# EAGLE design Metvoc (EAGLE 9.1.1)
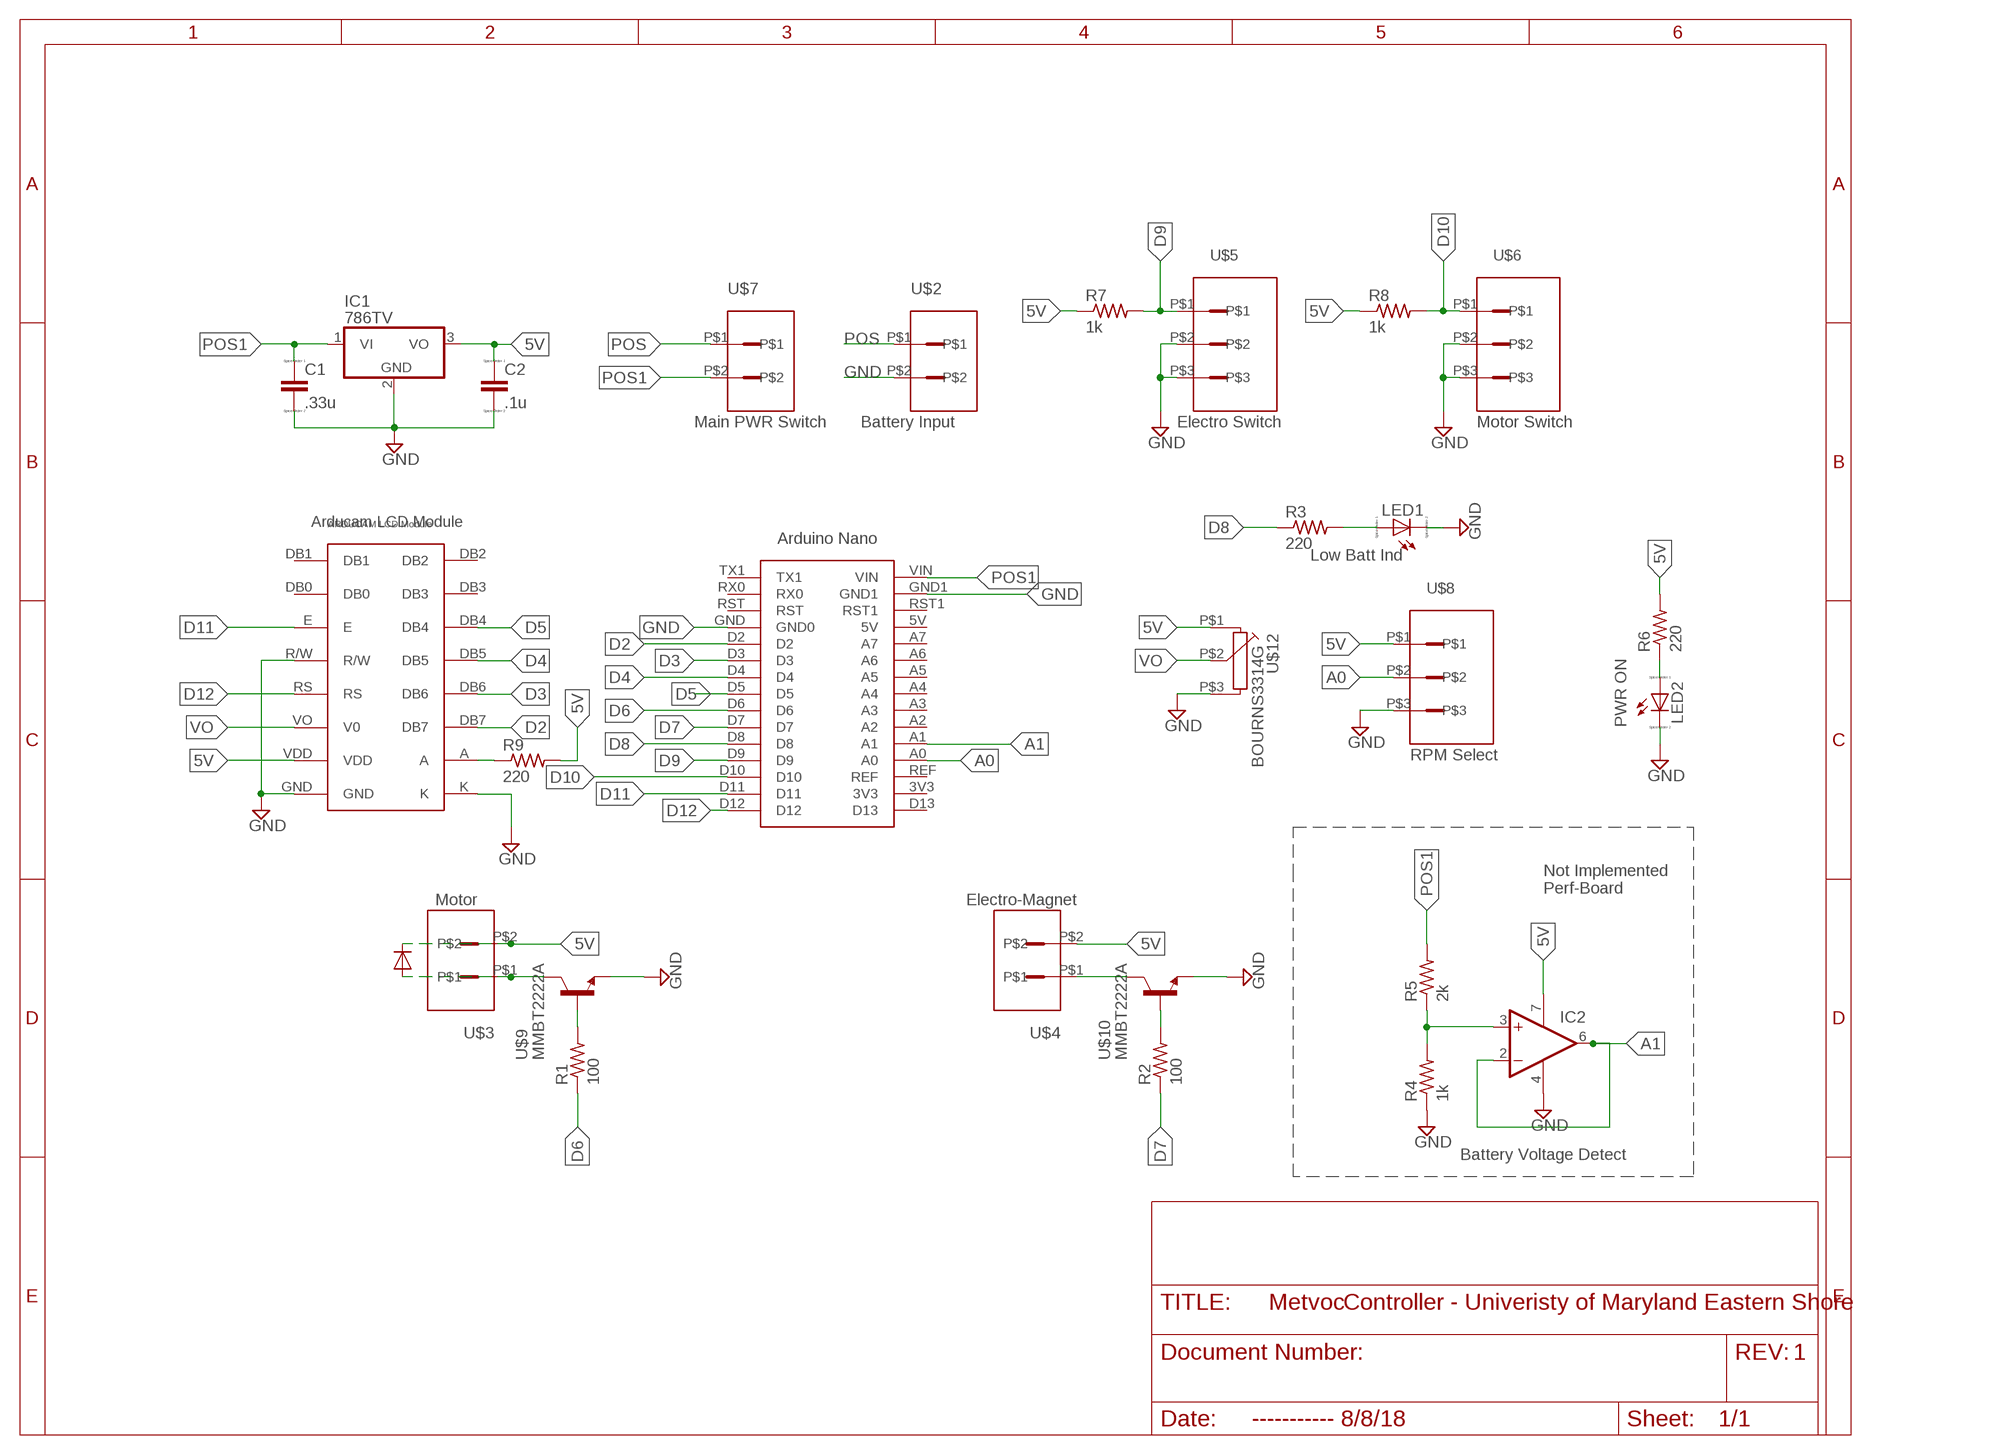
[diagram p0: schematic, sheet 1]

## Parts
C1  .33u  CC3216  [C3216]
C2  .1u  CC3216  [C3216]
IC1  786TV  [TO220V]
IC2  1AMP_P7+4D  [SO08]
LED1  LED_E  [LED_1206]
LED2  LED_E  [LED_1206]
R1  100  R-US_M1206  [M1206]
R2  100  R-US_M1206  [M1206]
R3  220  R-US_M1206  [M1206]
R4  1k  R-US_M1206  [M1206]
R5  2k  R-US_M1206  [M1206]
R6  220  R-US_M3216  [M3216]
R7  1k  R-US_M1206  [M1206]
R8  1k  R-US_M1206  [M1206]
R9  220  R-US_M1206  [M1206]
U$1  ARDUINO_NANO  [ARDUINONANO]
U$2  KF2510-2  [KF2540-2]
U$3  KF2510-2  [KF2540-2]
U$4  KF2510-2  [KF2540-2]
U$5  KF2510-3  [KF2540-3]
U$6  KF2510-3  [KF2540-3]
U$7  KF2510-2  [KF2540-2]
U$8  KF2510-3  [KF2540-3]
U$9  MMBT2222A  [SOT23]
U$10  MMBT2222A  [SOT23]
U$11  LCDMODULE  [LCDSCREEN]
U$12  BOURNS3314G  [3314POT]

## Nets
5V: C2.1 IC1.3(VO) IC2.7(V+) R6.2 R7.1 R8.1 R9.2 U$3.P$2 U$4.P$2 U$8.P$1 U$11.VDD U$12.P$1(1A)
A0: U$1.A0 U$8.P$2
A1: IC2.2(-IN) IC2.6(OUT) U$1.A1
D2: U$1.D2 U$11.DB7
D3: U$1.D3 U$11.DB6
D4: U$1.D4 U$11.DB5
D5: U$1.D5 U$11.DB4
D6: R1.1 U$1.D6
D7: R2.1 U$1.D7
D8: R3.1 U$1.D8
D9: R7.2 U$1.D9 U$5.P$1
D10: R8.2 U$1.D10 U$6.P$1
D11: U$1.D11 U$11.E
D12: U$1.D12 U$11.RS
GND: C1.2 C2.2 IC1.2(GND) IC2.4(V-) LED1.C LED2.C R4.1 U$1.GND1 U$1.GND(GND0) U$2.P$2 U$5.P$2 U$5.P$3 U$6.P$2 U$6.P$3 U$8.P$3 U$9.2(E) U$10.2(E) U$11.GND U$11.K U$11.R/W U$12.P$3(1E)
N$1: R1.2 U$9.1(B)
N$2: U$3.P$1 U$9.3(C)
N$3: U$4.P$1 U$10.3(C)
N$4: IC2.3(+IN) R4.2 R5.1
N$5: R2.2 U$10.1(B)
N$6: LED1.A R3.2
N$7: LED2.A R6.1
N$8: R9.1 U$11.A
POS: U$2.P$1 U$7.P$1
POS1: C1.1 IC1.1(VI) R5.2 U$1.VIN U$7.P$2
VO: U$11.VO(V0) U$12.P$2(1S)
Unconnected: U$1.3V3 U$1.5V U$1.A2 U$1.A3 U$1.A4 U$1.A5 U$1.A6 U$1.A7 U$1.D13 U$1.REF U$1.RST U$1.RST1 U$1.RX0 U$1.TX1 U$11.DB0 U$11.DB1 U$11.DB2 U$11.DB3

## Notes on the sheet
- Main PWR Switch | Battery Input | Electro Switch | Motor Switch
- Low Batt Ind
- PWR ON
- RPM Select
- Motor | Electro-Magnet
- Not Implemented 
  Perf-Board
- Battery Voltage Detect
- Controller - Univeristy of Maryland Eastern Shore
- 1
- ----------- 8/8/18

## Library data of the parts
C1 C2 = eagle-ltspice:C: CAPACITOR, European symbol; SPICEMODEL: NONE; SPICEPREFIX: C
IC1 = linear:78*: Positive VOLTAGE REGULATOR Source: http://cache.national.com/ds/LM/LM78L05.pdf http://www.fairchildsemi.com/ds/LM/LM7805.pdf
IC2 = linear:1AMP_P7+4: OP AMP
LED1 LED2 = eagle-ltspice:LED_E: LED Source: http://www.osram.convergy.de Source: www.luxeon.com Source: www.kingbright.com; SPICEMODEL: NONE; SPICEPREFIX: D; SPICETYPE: diode
R1-R9 = resistor:R-US_: RESISTOR, American symbol
U$1 = Metvoc:ARDUINO_NANO
U$2-U$4 U$7 = Metvoc:KF2510-2: KF2510-2 - 2 PIN Molex Connector
U$5 U$6 U$8 = Metvoc:KF2510-3: KF2510-3 - Molex Connector
U$9 U$10 = Metvoc:MMBT2222A: MMBT2222A - NPN Transistor
U$11 = Metvoc:LCDMODULE
U$12 = Metvoc:BOURNS3314G: Bourns 3314G-103ECT-ND - 10k Potentiometer

## Board
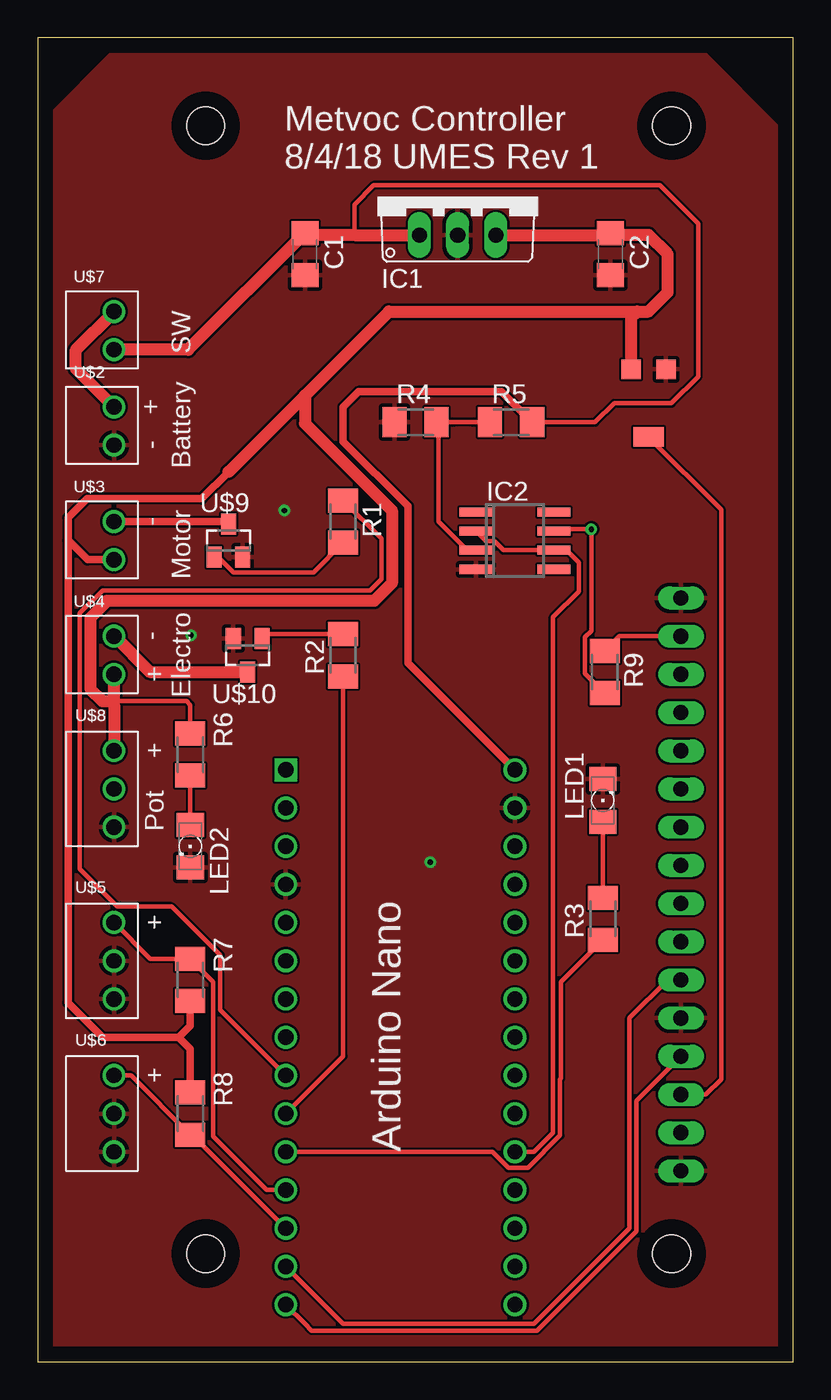
[diagram p1: board, top side]
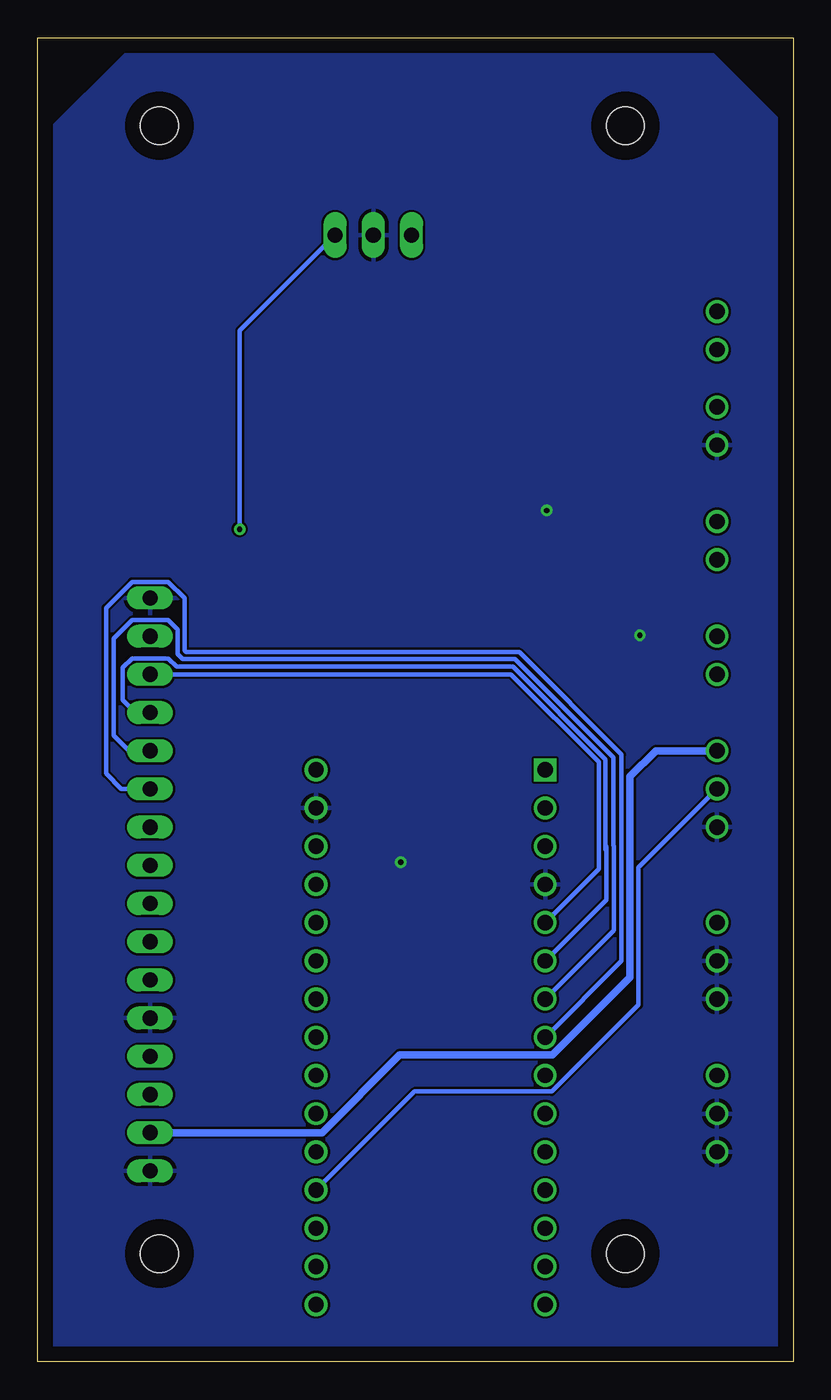
[diagram p2: board, bottom side, seen from below]

Size 50.27 x 88.06 mm. Coordinates in mm from the lower left corner, seen from the top.
Outline: 0,0 50.27,0 50.27,88.06 0,88.06 0,0
Copper layers (1*16): Top 0.035mm / dielectric 1.5mm / Bottom 0.035mm
Design rules "default": minimum track width 6mil, minimum drill 0.35mm, track to track 6mil, track to pad 6mil, pad to pad 6mil, via to via 6mil, smd to smd 6mil, copper to edge 40mil, drill to drill 6mil, minimum pad ring 10mil, minimum via ring 8mil, stop-mask expansion 4mil, vias tented up to drill 0mil, thermal gap 10mil

### Footprints (pad centres in the part's own frame; a part is rotated, then mirrored left to right if it is on the bottom)
C3216 = smd 1.6 x 1.8: 1 -1.4,0; 2 1.4,0
TO220V = drill 1.016 long: 1 -2.54,-2.54; 2 0,-2.54; 3 2.54,-2.54
SO08 = smd 0.6 x 2.2: 1 -1.905,-2.6; 2 -0.635,-2.6; 3 0.635,-2.6; 4 1.905,-2.6; 5 1.905,2.6; 6 0.635,2.6; 7 -0.635,2.6; 8 -1.905,2.6
LED_1206 = smd 1.6 x 1.803: A -1.422,0; C 1.422,0
M1206 = smd 1.6 x 2: 1 -1.4,0; 2 1.4,0
M3216 = smd 1.6 x 2: 1 -1.4,0; 2 1.4,0
ARDUINONANO = drill 1.016: 3V3 7.62,-15.24; 5V 7.62,10.16; A0 7.62,-10.16; A1 7.62,-7.62; A2 7.62,-5.08; A3 7.62,-2.54; A4 7.62,0; A5 7.62,2.54; A6 7.62,5.08; A7 7.62,7.62; D2 -7.62,7.62; D3 -7.62,5.08; D4 -7.62,2.54; D5 -7.62,0; D6 -7.62,-2.54; D7 -7.62,-5.08; D8 -7.62,-7.62; D9 -7.62,-10.16; D10 -7.62,-12.7; D11 -7.62,-15.24; D12 -7.62,-17.78; D13 7.62,-17.78; GND -7.62,10.16; GND1 7.62,15.24; REF 7.62,-12.7; RST -7.62,12.7; RST1 7.62,12.7; RX0 -7.62,15.24; VIN 7.62,17.78 | drill 1.016 square: TX1 -7.62,17.78
KF2540-2 = drill 1.016: P$1 0,1.27; P$2 0,-1.27
KF2540-3 = drill 1.016: P$1 0,2.54; P$2 0,0; P$3 0,-2.54
SOT23 = smd 1 x 1.4: 1 -0.95,-1.1; 2 0.95,-1.1; 3 0,1.1
LCDSCREEN = drill 1.016 long: A -16.12,35.56; DB0 -16.12,15.24; DB1 -16.12,17.78; DB2 -16.12,20.32; DB3 -16.12,22.86; DB4 -16.12,25.4; DB5 -16.12,27.94; DB6 -16.12,30.48; DB7 -16.12,33.02; E -16.12,12.7; GND -16.12,0; K -16.12,38.1; R/W -16.12,10.16; RS -16.12,7.62; VDD -16.12,2.54; VO -16.12,5.08 | hole 2.5: -15.5,-5.5; 15.5,-5.5; -15.5,69.5; 15.5,69.5
3314POT = smd 1.3 x 1.3: P$1 -1.15,2.25; P$3 1.15,2.25 | smd 2 x 1.3: P$2 0,-2.25

### Placement (x,y rotation side)
C1  17.78,73.66 270 top
C2  38.1,73.66 270 top
IC1  27.94,77.47 0 top
IC2  31.75,54.61 270 top
LED1  37.59,37.34 90 top
LED2  10.16,34.29 270 top
R1  20.32,55.88 270 top
R2  20.32,46.99 90 top
R3  37.59,29.46 90 top
R4  25.15,62.48 0 top
R5  31.5,62.48 0 top
R6  10.16,40.39 90 top
R7  10.16,25.4 90 top
R8  10.16,16.51 270 top
R9  37.72,45.87 270 top
U$1  24.13,21.59 0 top
U$2  5.08,62.23 0 top
U$3  5.08,54.61 0 top
U$4  5.08,46.99 0 top
U$5  5.08,26.67 0 top
U$6  5.08,16.51 0 top
U$7  5.08,68.58 0 top
U$8  5.08,38.1 0 top
U$9  12.7,54.61 0 top
U$10  13.97,46.99 180 top
U$11  26.67,12.7 0 bottom
U$12  40.64,63.75 0 top

### Tracks (layer width: path | path; a pad name or v marks a point on that pad's centre or on a via)
5V  (via drill 0.35)
  Top 0.305: R6.2 10.16,43.69 9.91,43.94 5.33,43.94 5.08,43.69 | IC2.7 34.48,55.37 v36.83,55.37 36.83,48.61 36.41,48.2 36.41,45.78 R9.2
  Top 0.498: 38.1,74.93 C2.1
  Top 0.508: 12.7,59.18 10.92,57.4 3.3,57.4 2.03,56.13 2.03,54.63 | 2.03,54.63 2.03,23.88 4.32,21.59 9.4,21.59 | 9.4,21.59 10.16,22.35 R7.1 | 9.4,21.59 10.16,20.83 R8.1 | U$3.P$2 3.33,53.34 2.03,54.63
  Top 0.813: IC1.3 38.1,74.93 40.64,74.93 41.91,73.66 41.91,71.12 40.64,69.85 39.88,69.85 | 39.88,69.85 23.37,69.85 17.78,64.26 | 12.7,59.18 17.78,64.26 | U$12.P$1 39.49,69.46 39.88,69.85 | 17.78,64.26 17.78,62.41 23.57,56.62 23.57,51.77 22.39,50.6 4.62,50.6 3.5,49.48 3.5,44.76 4.32,43.94 4.83,43.94 5.08,43.69 | 5.08,43.69 U$8.P$1 | 5.08,43.69 U$4.P$2
  Bottom 0.305: IC1.3 36.83,68.58 v36.83,55.37
  Bottom 0.508: U$8.P$1 9.14,40.64 10.87,38.91 10.87,25.58 16.03,20.42 26.19,20.42 31.37,15.24 U$11.VDD
A0
  Bottom 0.305: U$8.P$2 10.31,32.87 10.31,23.74 16.07,17.98 25.2,17.98 U$1.A0
A1
  Top 0.305: IC2.2 29.82,54.58 30.38,54.58 30.98,53.98 IC2.6 34.48,53.85 35.31,53.85 35.99,53.16 35.99,51.23 34.29,49.53 34.29,15.24 33.02,13.97 U$1.A1
D2
  Bottom 0.305: U$1.D2 12.95,32.77 12.95,34.04 | 12.95,34.04 12.95,34.29 | 12.95,34.04 12.95,39.88 18.8,45.72 U$11.DB7
D3
  Bottom 0.305: U$1.D3 12.45,30.73 12.45,34.04 | 12.45,34.04 12.45,34.29 | 12.45,34.04 12.5,34.09 12.5,40.07 18.66,46.23 41.03,46.23 41.59,46.79 43.99,46.79 44.62,46.16 44.62,44.03 43.77,43.18 U$11.DB6
D4
  Bottom 0.305: U$1.D4 11.94,28.7 11.94,34.29 11.99,34.34 11.99,40.21 18.52,46.74 40.64,46.74 40.96,47.06 40.96,48.7 41.59,49.33 43.99,49.33 45.21,48.11 45.21,41.66 44.2,40.64 U$11.DB5
D5
  Bottom 0.305: U$1.D5 11.43,26.67 11.43,40.39 18.24,47.19 40.39,47.19 40.5,47.31 40.5,50.78 41.59,51.87 43.99,51.87 45.72,50.14 45.72,39.12 44.7,38.1 U$11.DB4
D6
  Top 0.305: U$1.D6 12.14,23.42 12.14,27.05 8.91,30.28 5.28,30.28 2.79,32.77 2.79,49.78 4.32,51.31 22.1,51.31 22.86,52.07 22.86,54.74 R1.1
D7
  Top 0.305: U$1.D7 20.32,20.32 R2.1
D8
  Top 0.305: U$1.D8 30.24,13.97 31.31,12.9 32.6,12.9 34.75,15.05 34.75,18.8 34.8,18.85 34.8,25.27 R3.1
D9
  Top 0.305: U$1.D9 15.24,11.43 11.68,14.99 11.68,25.28 R7.2 7.49,26.8 U$5.P$1
D10
  Top 0.305: U$1.D10 10.29,15.11 R8.2 6.22,19.05 U$6.P$1
D11
  Top 0.305: U$1.D11 20.32,2.54 33.02,2.54 39.37,8.89 39.37,22.86 41.91,25.4 U$11.E
D12
  Top 0.305: U$1.D12 17.78,2.54 18.24,2.08 33.21,2.08 39.83,8.7 39.83,17.36 U$11.RS
GND  (via drill 0.35)
  other vias: 16.41,56.62 10.21,48.31 26.11,33.22
  pour Top: 0,0 50.04,0 50.29,0.25 50.29,81.03 50.04,81.28 43.43,87.88 38.61,87.88 5.84,87.88 0,82.04
  pour Bottom: 0,0 50.29,0 50.29,77.47 50.29,81.03 43.69,87.63 43.18,87.63 6.1,87.63 0,81.53
N$1
  Top 0.305: U$9.1 12.02,53.51 13.02,52.51 18.34,52.51 R1.2
N$2
  Top 0.508: U$3.P$1 12.53,55.88
  Top 0.61: 12.53,55.88 U$9.3
  Top 0.813: 5.25,55.71 U$3.P$1
N$3
  Top 0.813: U$4.P$1 7.45,45.89 U$10.3
N$4
  Top 0.305: R5.1 28.96,62.48 27.69,62.48 26.67,62.48 | 26.67,62.48 R4.2 | IC2.3 28.57,53.98 26.67,55.88 26.67,62.48 | 26.67,62.74 26.67,62.48 | 26.67,62.74 26.42,62.99 26.67,62.74 | 26.67,62.48 26.67,62.74
N$5
  Top 0.305: R2.2 15.22,48.39 U$10.1
N$6
  Top 0.305: R3.2 LED1.A
N$7
  Top 0.305: R6.1 LED2.A
N$8
  Top 0.305: R9.1 38.71,48.26 U$11.A
POS
  Top 0.813: U$2.P$1 2.54,66.04 2.54,67.31 U$7.P$1
POS1
  Top 0.305: R5.2 37.08,62.48 38.35,63.75 42.16,63.75 43.94,65.53 43.94,75.69 41.4,78.23 22.35,78.23 21.08,76.96 21.08,74.93
  Top 0.508: U$1.VIN 24.64,46.48 24.64,56.9 20.32,61.21 20.32,63.5 21.34,64.52 30.86,64.52 R5.2
  Top 0.813: IC1.1 21.08,74.93 17.91,74.93 C1.1 10.03,67.31 U$7.P$2
VO
  Top 0.305: U$12.P$2 45.47,56.68 45.47,18.8 44.45,17.78 U$11.VO

### Text on the board
tNames: Metvoc Controller / 8/4/18 UMES Rev 1 | SW | + | - | Battery | - | Motor | - | + | Electro | + | Pot | + | +
tValues: +
Document: SW
_tPlace: U$7 | U$2 | U$3 | U$4 | U$8 | U$5 | U$6
_tNames: C1 | C2 | IC1 | R4 | R5 | U$9 | R1 | IC2 | R9 | R2 | U$10 | R6 | LED2 | LED1 | R3 | R7 | R8
_: U$12 | U$12 | U$12 | U$12 | U$12 | U$12 | U$12 | U$12 | U$12 | U$12 | U$12 | U$12 | U$12